# EAGLE schematic buttonsModule (EAGLE 7.4.0)
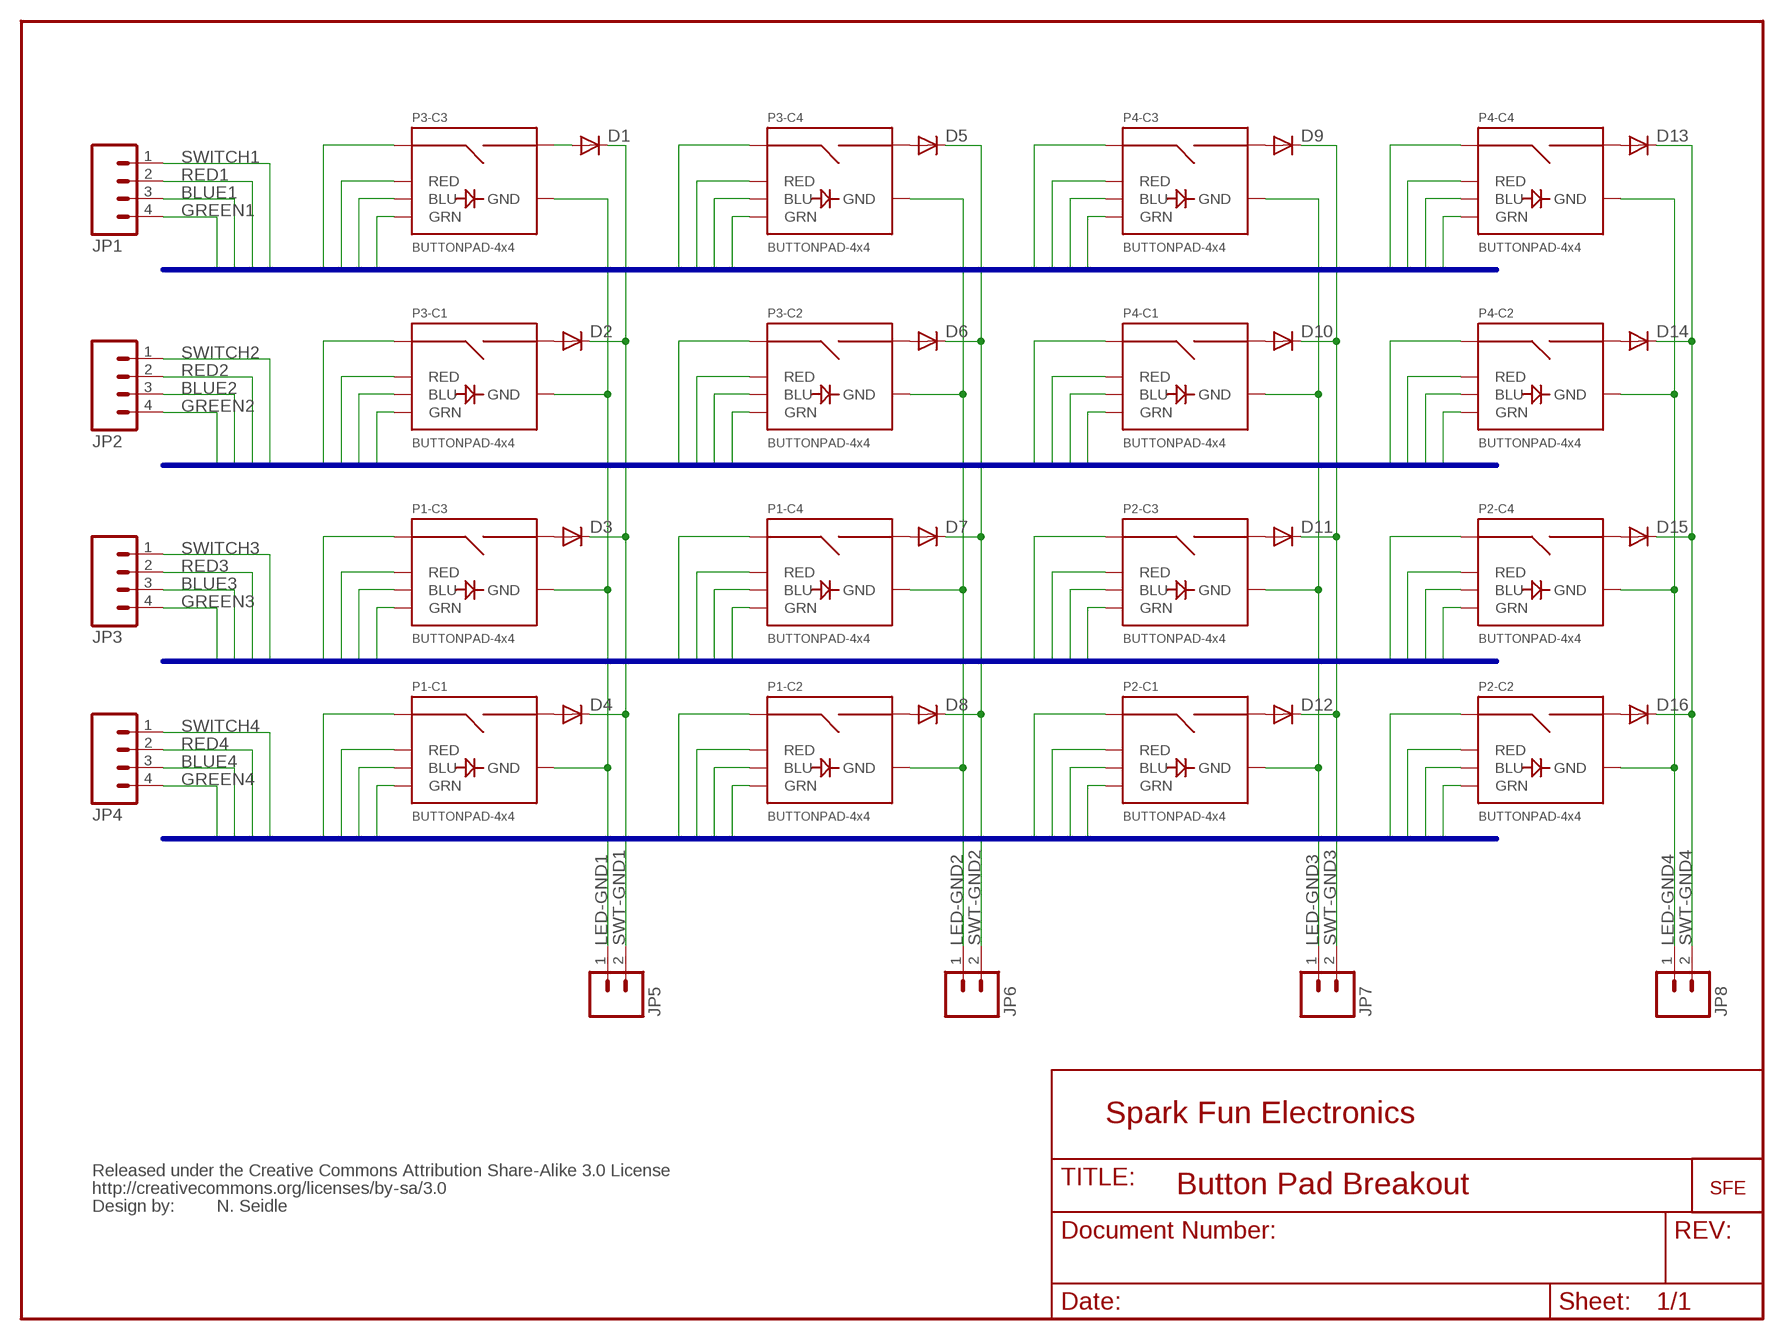
[diagram p0: schematic, sheet 1]

## Parts
D1  DIODE-1N4148  [DOIDE-1N4148]
D2  DIODE-1N4148  [DOIDE-1N4148]
D3  DIODE-1N4148  [DOIDE-1N4148]
D4  DIODE-1N4148  [DOIDE-1N4148]
D5  DIODE-1N4148  [DOIDE-1N4148]
D6  DIODE-1N4148  [DOIDE-1N4148]
D7  DIODE-1N4148  [DOIDE-1N4148]
D8  DIODE-1N4148  [DOIDE-1N4148]
D9  DIODE-1N4148  [DOIDE-1N4148]
D10  DIODE-1N4148  [DOIDE-1N4148]
D11  DIODE-1N4148  [DOIDE-1N4148]
D12  DIODE-1N4148  [DOIDE-1N4148]
D13  DIODE-1N4148  [DOIDE-1N4148]
D14  DIODE-1N4148  [DOIDE-1N4148]
D15  DIODE-1N4148  [DOIDE-1N4148]
D16  DIODE-1N4148  [DOIDE-1N4148]
JP1  M04POLAR  [MOLEX-1X4]
JP2  M04POLAR  [MOLEX-1X4]
JP3  M04POLAR  [MOLEX-1X4]
JP4  M04POLAR  [MOLEX-1X4]
JP5  M02POLAR  [MOLEX-1X2]
JP6  M02POLAR  [MOLEX-1X2]
JP7  M02POLAR  [MOLEX-1X2]
JP8  M02POLAR  [MOLEX-1X2]
P1  BUTTONPAD-4x4  BUTTONPAD-2X2  [BUTTONPAD-2X2]
P2  BUTTONPAD-4x4  BUTTONPAD-2X2  [BUTTONPAD-2X2]
P3  BUTTONPAD-4x4  BUTTONPAD-2X2  [BUTTONPAD-2X2]
P4  BUTTONPAD-4x4  BUTTONPAD-2X2  [BUTTONPAD-2X2]
U$1  LOGO-SFE  [SFE-NEW-WEBLOGO]
U$2  CREATIVE_COMMONS  [CREATIVE_COMMONS]

## Nets
BLUE1 [LEDPower]: JP1.3 P3.BLU3(-C3:BLU) P3.BLU4(-C4:BLU) P4.BLU3(-C3:BLU) P4.BLU4(-C4:BLU)
BLUE2 [LEDPower]: JP2.3 P3.BLU1(-C1:BLU) P3.BLU2(-C2:BLU) P4.BLU1(-C1:BLU) P4.BLU2(-C2:BLU)
BLUE3 [LEDPower]: JP3.3 P1.BLU3(-C3:BLU) P1.BLU4(-C4:BLU) P2.BLU3(-C3:BLU) P2.BLU4(-C4:BLU)
BLUE4 [LEDPower]: JP4.3 P1.BLU1(-C1:BLU) P1.BLU2(-C2:BLU) P2.BLU1(-C1:BLU) P2.BLU2(-C2:BLU)
GREEN1 [LEDPower]: JP1.4 P3.GRN3(-C3:GRN) P3.GRN4(-C4:GRN) P4.GRN3(-C3:GRN) P4.GRN4(-C4:GRN)
GREEN2 [LEDPower]: JP2.4 P3.GRN1(-C1:GRN) P3.GRN2(-C2:GRN) P4.GRN1(-C1:GRN) P4.GRN2(-C2:GRN)
GREEN3 [LEDPower]: JP3.4 P1.GRN3(-C3:GRN) P1.GRN4(-C4:GRN) P2.GRN3(-C3:GRN) P2.GRN4(-C4:GRN)
GREEN4 [LEDPower]: JP4.4 P1.GRN1(-C1:GRN) P1.GRN2(-C2:GRN) P2.GRN1(-C1:GRN) P2.GRN2(-C2:GRN)
LED-GND1 [LEDPower]: JP5.1 P1.GND1(-C1:GND) P1.GND3(-C3:GND) P3.GND1(-C1:GND) P3.GND3(-C3:GND)
LED-GND2 [LEDPower]: JP6.1 P1.GND2(-C2:GND) P1.GND4(-C4:GND) P3.GND2(-C2:GND) P3.GND4(-C4:GND)
LED-GND3 [LEDPower]: JP7.1 P2.GND1(-C1:GND) P2.GND3(-C3:GND) P4.GND1(-C1:GND) P4.GND3(-C3:GND)
LED-GND4 [LEDPower]: JP8.1 P2.GND2(-C2:GND) P2.GND4(-C4:GND) P4.GND2(-C2:GND) P4.GND4(-C4:GND)
N$1: D1.P$1(A) P3.SIG6(-C3:SIG2)
N$2: D2.P$1(A) P3.SIG2(-C1:SIG2)
N$3: D3.P$1(A) P1.SIG6(-C3:SIG2)
N$4: D4.P$1(A) P1.SIG2(-C1:SIG2)
N$5: D5.P$1(A) P3.SIG8(-C4:SIG2)
N$6: D6.P$1(A) P3.SIG4(-C2:SIG2)
N$7: D7.P$1(A) P1.SIG8(-C4:SIG2)
N$8: D8.P$1(A) P1.SIG4(-C2:SIG2)
N$9: D9.P$1(A) P4.SIG6(-C3:SIG2)
N$10: D10.P$1(A) P4.SIG2(-C1:SIG2)
N$11: D11.P$1(A) P2.SIG6(-C3:SIG2)
N$12: D12.P$1(A) P2.SIG2(-C1:SIG2)
N$13: D13.P$1(A) P4.SIG8(-C4:SIG2)
N$14: D14.P$1(A) P4.SIG4(-C2:SIG2)
N$15: D15.P$1(A) P2.SIG8(-C4:SIG2)
N$16: D16.P$1(A) P2.SIG4(-C2:SIG2)
RED1 [LEDPower]: JP1.2 P3.RED3(-C3:RED) P3.RED4(-C4:RED) P4.RED3(-C3:RED) P4.RED4(-C4:RED)
RED2 [LEDPower]: JP2.2 P3.RED1(-C1:RED) P3.RED2(-C2:RED) P4.RED1(-C1:RED) P4.RED2(-C2:RED)
RED3 [LEDPower]: JP3.2 P1.RED3(-C3:RED) P1.RED4(-C4:RED) P2.RED3(-C3:RED) P2.RED4(-C4:RED)
RED4 [LEDPower]: JP4.2 P1.RED1(-C1:RED) P1.RED2(-C2:RED) P2.RED1(-C1:RED) P2.RED2(-C2:RED)
SWITCH1 [ButtonSignal]: JP1.1 P3.SIG5(-C3:SIG1) P3.SIG7(-C4:SIG1) P4.SIG5(-C3:SIG1) P4.SIG7(-C4:SIG1)
SWITCH2 [ButtonSignal]: JP2.1 P3.SIG1(-C1:SIG1) P3.SIG3(-C2:SIG1) P4.SIG1(-C1:SIG1) P4.SIG3(-C2:SIG1)
SWITCH3 [ButtonSignal]: JP3.1 P1.SIG5(-C3:SIG1) P1.SIG7(-C4:SIG1) P2.SIG5(-C3:SIG1) P2.SIG7(-C4:SIG1)
SWITCH4 [ButtonSignal]: JP4.1 P1.SIG1(-C1:SIG1) P1.SIG3(-C2:SIG1) P2.SIG1(-C1:SIG1) P2.SIG3(-C2:SIG1)
SWT-GND1 [ButtonSignal]: D1.P$2(C) D2.P$2(C) D3.P$2(C) D4.P$2(C) JP5.2
SWT-GND2 [ButtonSignal]: D5.P$2(C) D6.P$2(C) D7.P$2(C) D8.P$2(C) JP6.2
SWT-GND3 [ButtonSignal]: D9.P$2(C) D10.P$2(C) D11.P$2(C) D12.P$2(C) JP7.2
SWT-GND4 [ButtonSignal]: D13.P$2(C) D14.P$2(C) D15.P$2(C) D16.P$2(C) JP8.2

## Buses
BUS3:RED3,BLUE3,GREEN3,SWITCH3
BUS2:RED2,BLUE2,GREEN2,SWITCH2
BUS1:RED1,BLUE1,GREEN1,SWITCH1
BUS4:RED4,BLUE4,GREEN4,SWITCH4

## Notes on the sheet
- Spark Fun Electronics
- Button Pad Breakout
- N. Seidle

## Library data of the parts
D1-D16 = SparkFun:DIODE-1N4148
JP1-JP4 = SparkFun:M04: Header 4 Standard 4-pin 0.1" header. Use with straight break away headers (SKU : PRT-00116), right angle break away headers (PRT-00553), swiss pins (PRT-00743), machine pins (PRT-00117), and female headers (PRT-00115). Molex polarized connector foot print use with SKU : PRT-08231 with associated crimp pins and housings.
JP5-JP8 = SparkFun:M02: Header 2 Standard 2-pin 0.1" header. Use with straight break away headers (SKU : PRT-00116), right angle break away headers (PRT-00553), swiss pins (PRT-00743), machine pins (PRT-00117), and female headers (PRT-00115). Molex polarized connector foot print use with SKU : PRT-08233 with associated crimp pins and housings.
P1-P4 = SparkFun:BUTTONPAD-2X2: 5mm Button Pad Proven layout and schematic for 2x2 button pad. Panelize this device/fp to a 4x4 pad if needed. Spark Fun Electronics SKU : COM-07835. Compatible common cathode tri-color LED SKU : COM-00105
U$1 = SparkFun:LOGO-SFE: Spark Fun Electronics PCB Logo This is the standard Spark Fun Electronics PCB logo.
U$2 = SparkFun:CREATIVE_COMMONS

## Net classes
0 Default: width 0.254 mm
1 Power: width 0.305 mm
2 LEDPower: width 0.305 mm
3 ButtonSignal: width 0.254 mm